# EAGLE design stamp_main_ESP32C3_V5_1 (EAGLE 9.6.2)
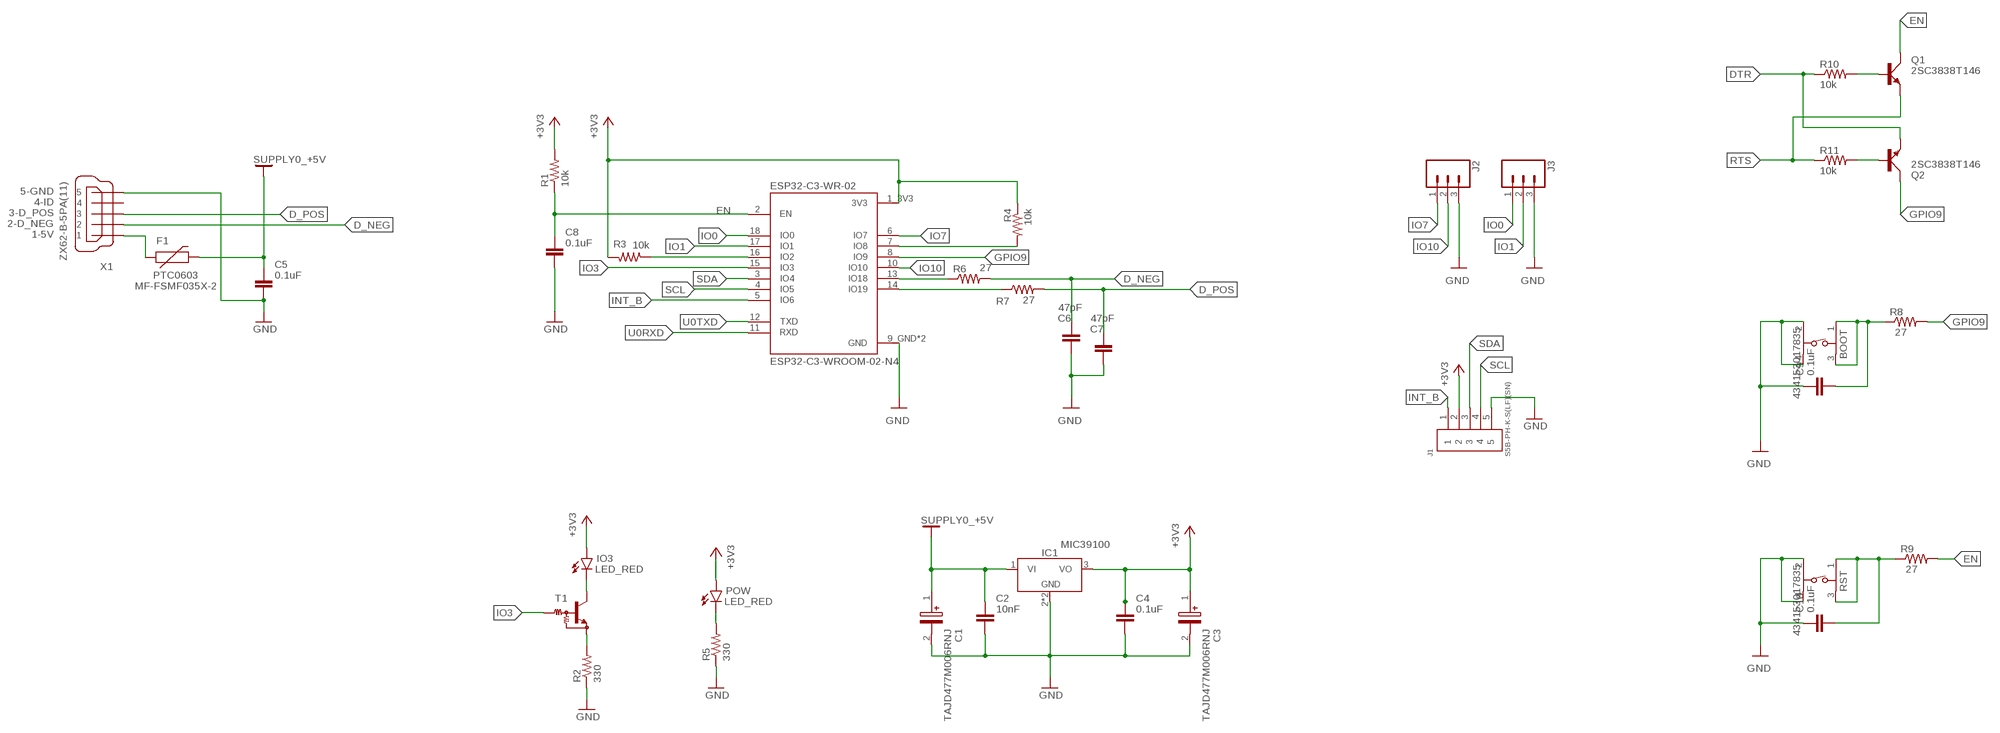
[diagram p0: schematic, sheet 1]

## Parts
BOOT  434153017835  [434153017835]
C1  TAJD477M006RNJ  [CAPPM7344X310N]
C2  10nF  C_CHIP-0603(1608-METRIC)  [CAPC1608X85]
C3  TAJD477M006RNJ  [CAPPM7344X310N]
C4  0.1uF  C_CHIP-0603(1608-METRIC)  [CAPC1608X85]
C5  0.1uF  C_CHIP-0603(1608-METRIC)  [CAPC1608X85]
C6  47pF  C_CHIP-0805(2012-METRIC)  [CAPC2012X110]
C7  47pF  C_CHIP-0805(2012-METRIC)  [CAPC2012X110]
C8  0.1uF  C_CHIP-0603(1608-METRIC)  [CAPC1608X85]
C9  0.1uF  C_CHIP-0603(1608-METRIC)  [CAPC1608X85]
C10  0.1uF  C_CHIP-0603(1608-METRIC)  [CAPC1608X85]
ESP32-C3-WR-02  ESP32-C3-WROOM-02-N4  [MODULE_ESP32-C3-WROOM-02-H4]
F1  PTC0603  [0603]
IC1  LM7805_SOT223  [SOT230P700X170-4]
IO3  LED_RED  LED_CHIP_RED-1608  [LEDC1608X39N_R]
J1  S5B-PH-K-S(LF)(SN)  [S5B-PH-K-S(LF)(SN)]
J2  CONN_03  [1X03]
J3  CONN_03  [1X03]
POW  LED_RED  LED_CHIP_RED-1608  [LEDC1608X39N_R]
Q1  2SC3838T146  [SC59]
Q2  2SC3838T146  [SC59]
R1  10k  R-US_R0805  [R0805]
R2  330  R-US_R0805  [R0805]
R3  10k  R-US_R0805  [R0805]
R4  10k  R-US_R0805  [R0805]
R5  330  R-US_R0805  [R0805]
R6  27  R-US_R0805  [R0805]
R7  27  R-US_R0805  [R0805]
R8  27  R-US_R0805  [R0805]
R9  27  R-US_R0805  [R0805]
R10  10k  R-US_R0805  [R0805]
R11  10k  R-US_R0805  [R0805]
RST  434153017835  [434153017835]
T1  MUN2211T1-NPN_DRIVER-SC59-BEC  [SC59-BEC]
X1  ZX62-B-5PA(11)  [ZX62-B-5PA(11)]

## Nets
+3V3 [PWR]: C3.1(+) C4.1 ESP32-C3-WR-02.1_3V3(3V3) IC1.3(VO) IO3.2(A) J1.2 POW.2(A) R1.2 R3.2 R4.1
+5V [PWR]: C1.1(+) C2.1 C5.1 F1.2 IC1.1(VI) ; supply symbol labelled SUPPLY0_+5V
D_NEG: C6.1 R6.2 X1.2
D_POS: C7.1 R7.2 X1.3
DTR: Q2.E R10.1
EN: C8.1 ESP32-C3-WR-02.2(EN) Q1.C R1.1 R9.2
GND [gnd]: BOOT.2 BOOT.4 C1.2(-) C2.2 C3.2(-) C4.2 C5.2 C6.2 C7.2 C8.2 C9.1 C10.1 ESP32-C3-WR-02.9_GND(GND) ESP32-C3-WR-02.P$1_GND(GND) IC1.2(GND) IC1.4(GND) J1.5 J2.3 J3.3 R2.1 R5.1 RST.2 RST.4 X1.5
GPIO9: ESP32-C3-WR-02.8(IO9) Q2.C R8.2
INT_B: ESP32-C3-WR-02.5(IO6) J1.1
IO0: ESP32-C3-WR-02.18(IO0) J3.1
IO1: ESP32-C3-WR-02.17(IO1) J3.2
IO3: ESP32-C3-WR-02.15(IO3) T1.B
IO7: ESP32-C3-WR-02.6(IO7) J2.1
IO10: ESP32-C3-WR-02.10(IO10) J2.2
N$1: ESP32-C3-WR-02.16(IO2) R3.1
N$2: ESP32-C3-WR-02.7(IO8) R4.2
N$3 [PWR]: F1.1 X1.1
N$4: C10.2 R9.1 RST.1 RST.3
N$5: IO3.1(C) T1.C
N$7: BOOT.1 BOOT.3 C9.2 R8.1
N$8: Q1.B R10.2
N$9: Q2.B R11.2
N$10: POW.1(C) R5.2
N$12: R2.2 T1.E
N$22: ESP32-C3-WR-02.13(IO18) R6.1
N$23: ESP32-C3-WR-02.14(IO19) R7.1
RTS: Q1.E R11.1
SCL: ESP32-C3-WR-02.4(IO5) J1.4
SDA: ESP32-C3-WR-02.3(IO4) J1.3
U0RXD: ESP32-C3-WR-02.11(RXD)
U0TXD: ESP32-C3-WR-02.12(TXD)
Unconnected: X1.4 X1.S1 X1.S2 X1.S3 X1.S4

## Library data of the parts
BOOT RST = Wurth_Switch_WS-TASV:434153017835: WS-TASV J-Bend SMT Tact Switch 3.5x2.9 mm Material Properties Cover Material : Stainless Steel Properties Actuator Material:LCP Actuator Flammability Rating:UL94 V-0 Actuator Color:Blue Frame Material:PA46 Frame Flammability Rating:UL94 HB Frame Color:Black Contact Material:Stainless Steel Contact Plating:Silver Terminal Material:Copper Alloy Terminal Plating:Silver VR:12 V (DC) Contact Resistance Initial:100 mΩ Contact Resistance After Life Test:1 Ω RISO:100 MΩ Withstanding Voltage:250 V (AC) Washable:No Qty.:4000 Mechanical Properties Stroke :0.15 mm General Information Operating Temperature:-40 up to +85 °C Washable:No Packaging Properties Packaging:Tape and Reel <https://www.we-online.com/catalog/media/o72753v209%20WS-TASU_434331013822_a_4C.jpg> Details see: https://www.we-online.com/catalog/en/TASV_3_5X2_9_SMD_J-BEND/ Updated by yingchun,Shan;2020-02-18 2020(C) Würth Elektronik; DATASHEET-URL: https://www.we-online.com/redexpert/spec/434153017835?ae; H: 1.7mm; OPERATION-FORCE: 350g; PART-NUMBER: 434153017835; QTY: 4000
C1 C3 = TAJD477M006RNJ:TAJD477M006RNJ: Tantalum Capacitors - Solid SMD 6.3volts 470uF 20% Source: Datasheet <https://componentsearchengine.com/Datasheets/1/TAJD477M006RNJ.pdf>; DESCRIPTION: Tantalum Capacitors - Solid SMD 6.3volts 470uF 20%; HEIGHT: 3.1mm; MANUFACTURER_NAME: AVX; MANUFACTURER_PART_NUMBER: TAJD477M006RNJ; MOUSER_PART_NUMBER: 581-TAJD477M006R; MOUSER_PRICE-STOCK: https://www.mouser.com/Search/Refine.aspx?Keyword=581-TAJD477M006R
C2 C4-C10 = Capacitor:C: Capacitor - Generic; CATEGORY: Capacitor
ESP32-C3-WR-02 = ESP32-C3-WROOM-02-N4:ESP32-C3-WROOM-02-N4: WiFi Modules (802.11) (Engineering Samples) SMD module, ESP32-C3, 4MB SPI flash, PCB antenna, -40 C +105 C Check availability <https://pricing.snapeda.com/parts/ESP32-C3-WROOM-02-H4/Espressif%20Systems/view-part?ref=eda> Check availability <https://pricing.snapeda.com/parts/ESP32-C3-WROOM-02-N4/Espressif%20Systems/view-part?ref=eda>; AVAILABILITY: In Stock; DESCRIPTION: WiFi Modules (802.11) (Engineering Samples) SMD module, ESP32-C3, 4MB SPI flash, PCB antenna, -40 C +85 C; MF: Espressif Systems; MP: ESP32-C3-WROOM-02-N4; PACKAGE: Package; PRICE: None; PURCHASE-URL: https://pricing.snapeda.com/search/part/ESP32-C3-WROOM-02-N4/?ref=eda
F1 = bt:PTC: Resettable Fuse PTC Resettable Fuse. Spark Fun Electronics SKU : COM-08357
IC1 = Tinkercad:LM7805: 5V Voltage Regulator Reference Datasheet <https://www.ti.com/lit/ds/symlink/lm340.pdf>
IO3 POW = Opto-Electronic:LED_CHIP: LED - Generic; CATEGORY: Opto-Electronic; COLOR: Red; SUB-CATEGORY: LED
J1 = Headers:S5B-PH-K-S(LF)(SN): CONN HEADER R/A 5POS 2MM Manufacturer's datasheet <http://www.jst-mfg.com/product/pdf/eng/ePH.pdf>; CREATED_BY: PCBLayout.com; DIGIKEY_PARTNO: 455-1722-ND; MANUFACTURER: JST Sales America Inc.; MPN: S5B-PH-K-S(LF)(SN)
J2 J3 = SparkFun-Connectors:CONN_03: Multi connection point. Often used as Generic Header-pin footprint for 0.1 inch spaced/style header connections On any of the 0.1 inch spaced packages, you can populate with these: Break Away Headers - Straight <https://www.sparkfun.com/products/116> (PRT-00116) Break Away Male Headers - Right Angle <https://www.sparkfun.com/products/553> (PRT-00553) Female Headers <https://www.sparkfun.com/products/115> (PRT-00115) Break Away Headers - Machine Pin <https://www.sparkfun.com/products/117> (PRT-00117) Break Away Female Headers - Swiss Machine Pin <https://www.sparkfun.com/products/743> (PRT-00743) Stackable Header - 3 Pin (Female, 0.1") <https://www.sparkfun.com/products/13875> (PRT-13875) For SCREWTERMINALS and SPRING TERMINALS visit here: Screw Terimnals on SparkFun.com <https://www.sparkfun.com/search/results?term=Screw+Terminals> (5mm/3.5mm/2.54mm spacing) This device is also useful as a general connection point to wire up your design to another part of your project. Our various solder wires solder well into these plated through hole pads. Hook-Up Wire - Assortment (Stranded, 22 AWG) <https://www.sparkfun.com/products/11375> (PRT-11375) Hook-Up Wire - Assortment (Solid Core, 22 AWG) <https://www.sparkfun.com/products/11367> (PRT-11367) View the entire wire category on our website here <https://www.sparkfun.com/categories/141> Special notes: Molex polarized connector foot print use with SKU : PRT-08232 with associated crimp pins and housings.
Q1 Q2 = transistor-small-signal:2SC3838: High-Frequency Amplifier Transistor 11V, 50mA, 3.2GHz (Rohm)
R1-R11 = resistor:R-US_: RESISTOR, American symbol
T1 = transistor:*-NPN_DRIVER-: NPN Bias Resistor Transistor
X1 = hirose-zx:ZX62-B-5PA(11): Micro USB Connector HI-SPEED Certified Source: https://www.hirose.co.jp/catalogj_hp/jd_ZX_20140305.pdf

## Net classes
0 default: width 0.152 mm, clearance 0.152 mm
1 PWR: width 0.203 mm, clearance 0.152 mm
2 gnd: width 0.203 mm, clearance 0.203 mm

## Board
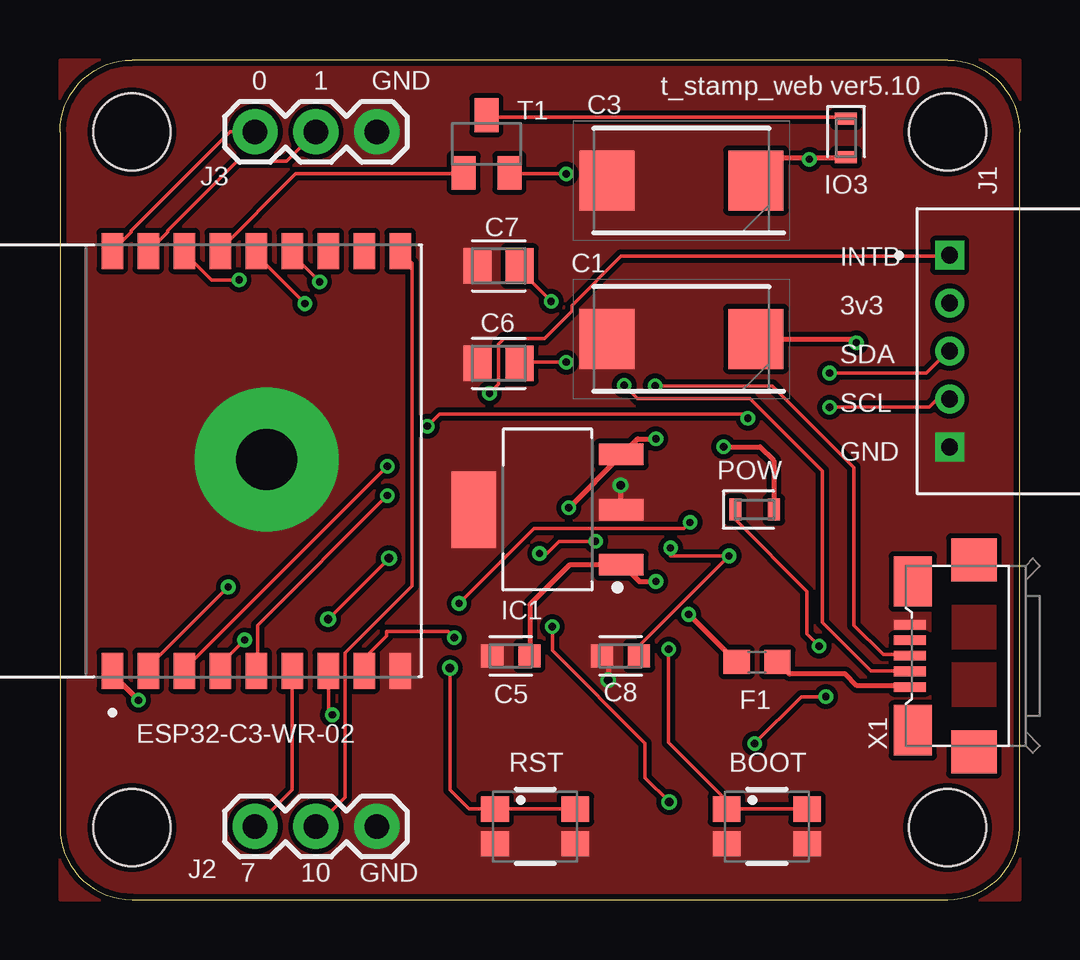
[diagram p1: board, top side]
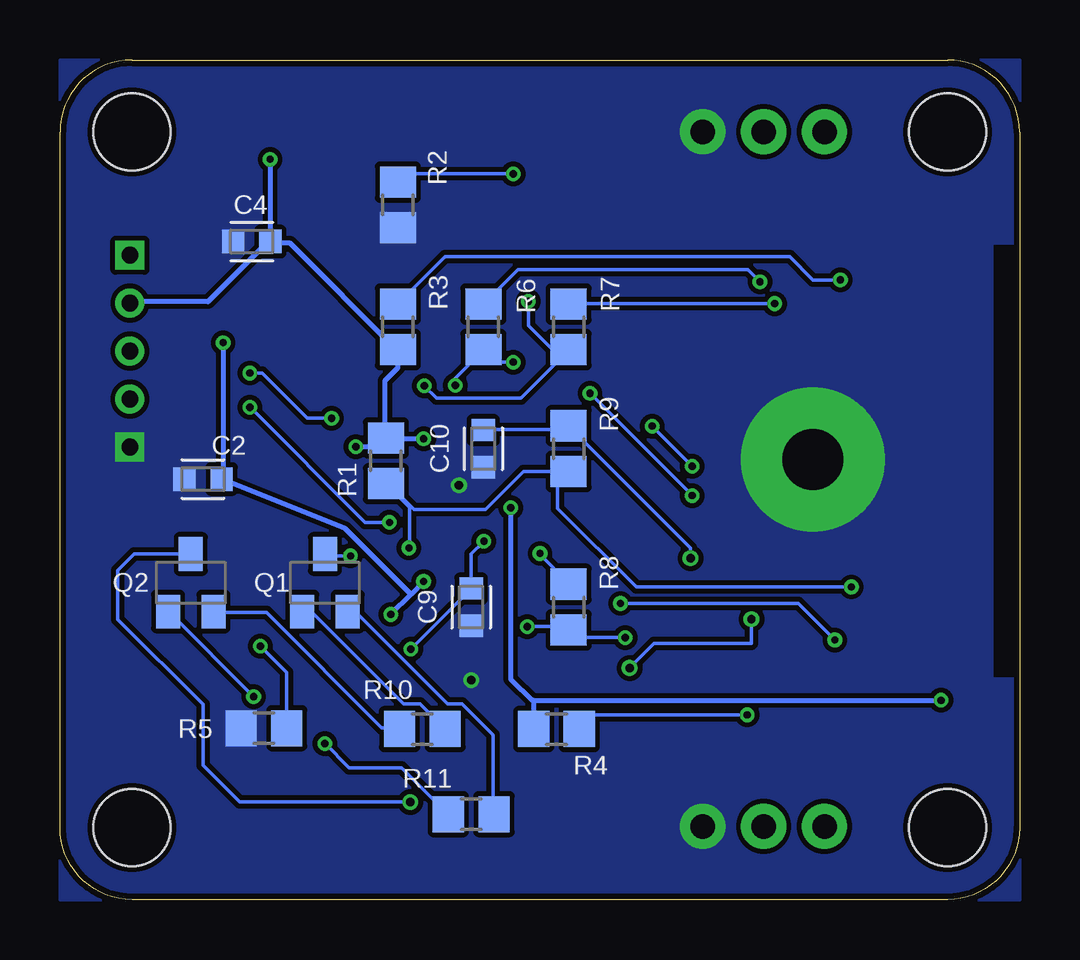
[diagram p2: board, bottom side, seen from below]

Size 40 x 35 mm. Coordinates in mm from the lower left corner, seen from the top.
Outline: 3,0 37,0 arc90 40,3 40,32 arc90 37,35 3,35 arc90 0,32 0,3 arc90 3,0
Copper layers (1*16): Top 0.035mm / dielectric 1.5mm / Bottom 0.035mm
Design rules "SeeedStudio_2layer_DRU_no_angle_20140221": minimum track width 6mil, minimum drill 12mil, track to track 6mil, track to pad 6mil, pad to pad 6mil, via to via 6mil, smd to smd 0mil, copper to edge 10mil, drill to drill 10mil, minimum pad ring 10mil, minimum via ring 6mil, stop-mask expansion 2mil, vias tented up to drill 100mil, thermal gap 10mil
Holes 3.2 mm at 3,3 3,32 37,32 37,3

### Footprints (pad centres in the part's own frame; a part is rotated, then mirrored left to right if it is on the bottom)
434153017835 = smd 1.15 x 1.05: 1 -1.675,0.725; 2 -1.675,-0.725; 3 1.675,0.725; 4 1.675,-0.725
CAPPM7344X310N = smd 2.3 x 2.5: 1 -3.1,0; 2 3.1,0
CAPC1608X85 = smd 0.921 x 0.97: 1 -0.775,0; 2 0.775,0
CAPC2012X110 = smd 1.165 x 1.465: 1 -0.875,0; 2 0.875,0
MODULE_ESP32-C3-WROOM-02-H4 = smd 1.5 x 0.9: 1_3V3 -8.75,2.9; 2 -8.75,1.4; 3 -8.75,-0.1; 4 -8.75,-1.6; 5 -8.75,-3.1; 6 -8.75,-4.6; 7 -8.75,-6.1; 8 -8.75,-7.6; 9_GND -8.75,-9.1; 10 8.75,-9.1; 11 8.75,-7.6; 12 8.75,-6.1; 13 8.75,-4.6; 14 8.75,-3.1; 15 8.75,-1.6; 16 8.75,-0.1; 17 8.75,1.4; 18 8.75,2.9 | drill 2.54 pad 6: P$1_GND 0.056,-3.531
0603 = smd 1.1 x 1: 1 -0.85,0; 2 0.85,0
SOT230P700X170-4 = smd 1.86 x 0.898: 1 -3.075,2.3; 2 -3.075,0; 3 -3.075,-2.3 | smd 1.86 x 3.189: 4 3.075,0
LEDC1608X39N_R = smd 0.512 x 0.912: 1 -0.8,0; 2 0.8,0
S5B-PH-K-S(LF)(SN) = drill 0.7 square: 1 4,0; 5 -4,0 | drill 0.7: 2 2,0; 3 0,0; 4 -2,0
1X03 = drill 1.016 pad 1.88: 1 0,0; 2 2.54,0; 3 5.08,0
SC59 = smd 1 x 1.4: B -0.95,-1.2; C 0,1.2; E 0.95,-1.2
R0805 = smd 1.3 x 1.5: 1 -0.95,0; 2 0.95,0
SC59-BEC = smd 1 x 1.4: B -0.95,-1.2; C 0,1.2; E 0.95,-1.2
ZX62-B-5PA(11) = smd 1.35 x 0.4: 1 2.675,1.3; 2 2.675,0.65; 3 2.675,0; 4 2.675,-0.65; 5 2.675,-1.3 | smd 1.9 x 1.8: S1 0,-4; S2 0,4 | smd 1.6 x 2.1: S3 2.55,-3.1; S4 2.55,3.1

### Placement (x,y rotation side)
BOOT  29.46,3.05 0 top
C1  25.91,23.37 180 top
C2  34.04,17.53 180 bottom
C3  25.91,29.97 180 top
C4  32,27.43 180 bottom
C5  18.8,10.16 180 top
C6  18.29,22.35 180 top
C7  18.29,26.42 180 top
C8  23.37,10.16 180 top
C9  22.86,12.19 90 bottom
C10  22.35,18.8 90 bottom
ESP32-C3-WR-02  5.08,18.29 90 top
F1  29.06,9.91 180 top
IC1  20.32,16.26 180 top
IO3  32.77,31.75 270 top
J1  37.08,22.86 90 top
J2  8.13,3.05 0 top
J3  8.13,32 0 top
POW  28.96,16.26 0 top
Q1  28.96,13.21 0 bottom
Q2  34.54,13.21 0 bottom
R1  26.42,18.29 90 bottom
R2  25.91,28.96 90 bottom
R3  25.91,23.88 270 bottom
R4  19.3,7.11 0 bottom
R5  31.5,7.14 0 bottom
R6  22.35,23.88 270 bottom
R7  18.8,23.88 270 bottom
R8  18.8,12.19 270 bottom
R9  18.8,18.8 270 bottom
R10  24.89,7.11 0 bottom
R11  22.86,3.56 180 bottom
RST  19.81,3.05 0 top
T1  17.78,31.5 0 top
X1  38.1,10.16 180 top

### Tracks (layer width: path | path; a pad name or v marks a point on that pad's centre or on a via)
+3V3  (via drill 0.3)
  Top 0.203: 31.24,30.94 29.95,30.94 29.03,30.02 C3.1 | 31.24,30.94 32.72,30.94 IO3.2 | v31.24,30.86 31.24,30.94 | v27.66,18.87 29.18,18.87 29.76,18.3 POW.2 | v21.21,16.33 23.39,18.52 IC1.3 23.47,18.59 24.08,19.2 v24.84,19.2 | v3.28,8.31 2.21,9.37 2.21,9.53 ESP32-C3-WR-02.1_3V3
  Bottom 0.203: v31.24,30.86 31.24,27.43 C4.1 | J1.2 37.03,24.92 33.83,24.92 31.32,27.43 C4.1 | v27.66,18.87 26.77,18.87 26.44,19.2 R1.2 | R1.2 26.44,19.28 26.44,21.64 25.91,22.17 R3.2 25.98,22.94 30.4,27.36 31.17,27.36 C4.1 | 20.27,8.26 20.27,8.31 v3.28,8.31 | 20.27,8.26 20.27,7.16 R4.1 | 20.27,8.26 21.21,9.2 v21.21,16.33 | v24.84,19.2 26.36,19.2 R1.2
+5V  (via drill 0.3)
  Top 0.203: v33.2,23.22 33.05,23.37 C1.1 | C5.1 19.58,10.21 19.58,12.29 21.23,13.95 23.39,13.95 IC1.1 23.47,13.95 24.16,13.26 v24.84,13.26 | v26.21,11.89 28.19,9.91 F1.2
  Bottom 0.203: v33.2,23.22 33.2,17.59 C2.1 28.12,15.47 25.38,12.72 | v24.84,13.26 25.38,12.72 | 25.38,12.72 v26.21,11.89
D_NEG  (via drill 0.3)
  Top 0.152: v23.52,21.44 24.08,20.88 28.75,20.88 31.77,17.86 31.77,11.56 33.81,9.53 35.36,9.53 X1.2 | v21.11,22.4 19.2,22.4 C6.1
  Bottom 0.152: v23.52,21.44 23.52,21.74 22.4,22.86 R6.2 22.33,22.86 21.87,22.4 v21.11,22.4
D_POS  (via drill 0.3)
  Top 0.152: v24.82,21.41 29.69,21.41 33.1,18.01 33.1,11.43 34.31,10.21 35.36,10.21 X1.3 | v20.47,24.94 19.2,26.21 19.2,26.36 C7.1
  Bottom 0.152: v24.82,21.41 24.31,20.9 20.78,20.9 18.82,22.86 R7.2 19.47,22.93 20.47,23.93 v20.47,24.94
DTR
  Bottom 0.152: Q2.E 33.53,11.96 31.39,11.96 26.59,7.16 25.91,7.16 R10.1
EN  (via drill 0.3)
  Top 0.152: C8.1 24.16,10.21 24.16,10.59 v27.89,14.33 25.45,14.33 v25.45,14.66 | v7.01,13.03 3.73,9.75 3.73,9.6 ESP32-C3-WR-02.2
  Bottom 0.152: v27.89,14.33 28.88,14.33 Q1.C | v25.45,14.66 25.43,14.68 25.43,16.35 R1.1 26.36,17.37 25.25,16.26 22.27,16.26 20.68,17.85 R9.2 19.25,17.39 19.25,16.31 15.98,13.03 15.75,13.03 v7.01,13.03
GND  (via drill 0.35)
  Top 0.203: IC1.2 23.39,17.25 v23.37,17.27 | C8.2 22.86,9.89 v22.86,9.14
  pour Top (no thermals): 0,35 40,35 40,0 0,0
  pour Bottom (no thermals): 0,35 40,35 40,0 0,0
GPIO9  (via drill 0.3, 0.35)
  Top 0.152: ESP32-C3-WR-02.8 12.68,10.05 13.62,10.99 13.62,11.18 16.18,11.18 v16.43,10.92 | v25.4,4.06 24.38,5.08 24.38,6.52 20.52,10.38 v20.52,11.38
  Bottom 0.152: v20.52,11.38 18.85,11.38 R8.2 18.48,10.92 v16.43,10.92 | Q2.C 34.52,14.4 36.91,14.4 37.59,13.72 37.59,11.68 34.04,8.13 34.04,5.59 32.51,4.06 v25.4,4.06
INT_B  (via drill 0.3)
  Top 0.152: v13.64,16.84 8.23,11.43 8.23,9.6 ESP32-C3-WR-02.5 | v17.91,21.11 18.29,21.49 18.29,23.16 18.52,23.39 20.19,23.39 21.34,24.54 21.34,24.77 23.39,26.82 37.03,26.82 J1.1
  Bottom 0.152: v17.91,21.11 v13.64,16.84
IO0
  Top 0.152: J3.1 7.09,32 2.97,27.89 2.97,27.81 2.21,27.05 ESP32-C3-WR-02.18
IO1
  Top 0.152: J3.2 9.45,30.79 7.39,30.79 4.5,27.89 4.5,27.81 3.73,27.05 ESP32-C3-WR-02.17
IO3
  Top 0.152: T1.B 16.76,30.25 9.83,30.25 6.63,27.05 ESP32-C3-WR-02.15
IO7
  Top 0.152: ESP32-C3-WR-02.6 9.68,9.53 9.68,4.57 8.15,3.05 J2.1
IO10
  Top 0.152: ESP32-C3-WR-02.10 14.68,26.54 14.68,13.08 11.89,10.29 11.89,4.27 J2.2
N$1  (via drill 0.3)
  Top 0.152: v7.47,25.83 6.33,25.83 5.18,26.98 ESP32-C3-WR-02.16
  Bottom 0.152: v7.47,25.83 8.61,25.83 9.58,26.8 23.95,26.8 25.91,24.84 R3.1
N$2  (via drill 0.3)
  Top 0.152: v11.35,7.7 11.2,7.85 11.2,9.53 ESP32-C3-WR-02.7
  Bottom 0.152: v11.35,7.7 17.75,7.7 18.29,7.16 R4.2
N$3
  Top 0.203: F1.1 30.42,9.4 32.74,9.4 33.22,8.91 35.36,8.91 X1.1
N$4  (via drill 0.35)
  Top 0.152: v13.72,14.22 v11.18,11.68 | v16.26,9.65 16.26,4.57 17.05,3.77 RST.1 RST.3
  Bottom 0.152: C10.2 22.33,19.58 18.97,19.58 18.82,19.74 R9.1 13.72,14.67 v13.72,14.22 | v11.18,11.68 11.18,10.67 15.24,10.67 v16.26,9.65
N$5
  Top 0.152: IO3.1 32.72,32.61 17.91,32.61 17.83,32.69 T1.C
N$7  (via drill 0.3)
  Top 0.152: v19.99,14.43 20.3,14.43 20.8,14.94 v22.33,14.94 | v25.38,10.44 25.38,6.55 27.79,4.14 BOOT.1 BOOT.3
  Bottom 0.152: v22.33,14.94 22.86,14.4 C9.2 22.86,12.95 v25.38,10.44 | v19.99,14.43 19.99,14.38 18.82,13.21 R8.1
N$8
  Bottom 0.152: Q1.B 29.87,11.96 29.49,11.96 25.68,8.15 24.99,8.15 24,7.16 R10.2
N$9  (via drill 0.3)
  Top 0.152: v31.93,8.46 30.91,8.46 v28.96,6.5
  Bottom 0.152: v31.93,8.46 35.43,11.96 Q2.B | v28.96,6.5 27.94,5.49 25.76,5.49 23.85,3.58 R11.2
N$10  (via drill 0.3)
  Top 0.152: v31.65,10.57 31.14,11.07 31.14,12.85 28.19,15.8 28.19,16.23 POW.1
  Bottom 0.152: v31.65,10.57 30.55,9.46 R5.2
N$12  (via drill 0.3)
  Top 0.152: v21.11,30.25 18.75,30.25 T1.E
  Bottom 0.152: v21.11,30.25 25.6,30.25 25.91,29.95 R2.2
N$22  (via drill 0.3)
  Top 0.152: v10.82,25.76 9.75,26.82 9.75,26.98 ESP32-C3-WR-02.13
  Bottom 0.152: v10.82,25.76 11.33,26.26 20.9,26.26 22.33,24.84 R6.1
N$23  (via drill 0.3)
  Top 0.152: v10.21,24.84 8.23,26.82 8.23,26.98 ESP32-C3-WR-02.14
  Bottom 0.152: v10.21,24.84 18.75,24.84 R7.1
RTS
  Bottom 0.152: Q1.E 27.96,11.96 27.66,11.96 23.85,8.15 23.24,8.15 21.95,6.86 21.95,3.58 R11.1
SCL  (via drill 0.3)
  Top 0.152: v7.7,10.82 6.71,9.83 6.71,9.6 ESP32-C3-WR-02.4 | v16.64,12.34 19.76,15.47 26.01,15.47 v26.26,15.72 | v32.08,20.52 36.25,20.52 36.58,20.86 J1.4
  Bottom 0.152: v7.7,10.82 9.22,12.34 v16.64,12.34 | v32.08,20.52 27.28,15.72 v26.26,15.72
SDA  (via drill 0.3)
  Top 0.152: v13.64,18.06 5.18,9.6 ESP32-C3-WR-02.3 | v28.68,20.07 28.5,20.24 15.82,20.24 v15.32,19.74 | v32.08,21.95 36.12,21.95 37.03,22.86 J1.3
  Bottom 0.152: v15.32,19.74 v13.64,18.06 | v32.08,21.95 31.57,21.95 29.69,20.07 v28.68,20.07

### Text on the board
tNames: 0 | 1 | GND | t_stamp_web ver5.10 | INTB | 3v3 | SDA | SCL | GND | 7 | 10 | GND